# EAGLE design Final Project (EAGLE 8.6.3)

## Sheet 1 of 2: Power supply
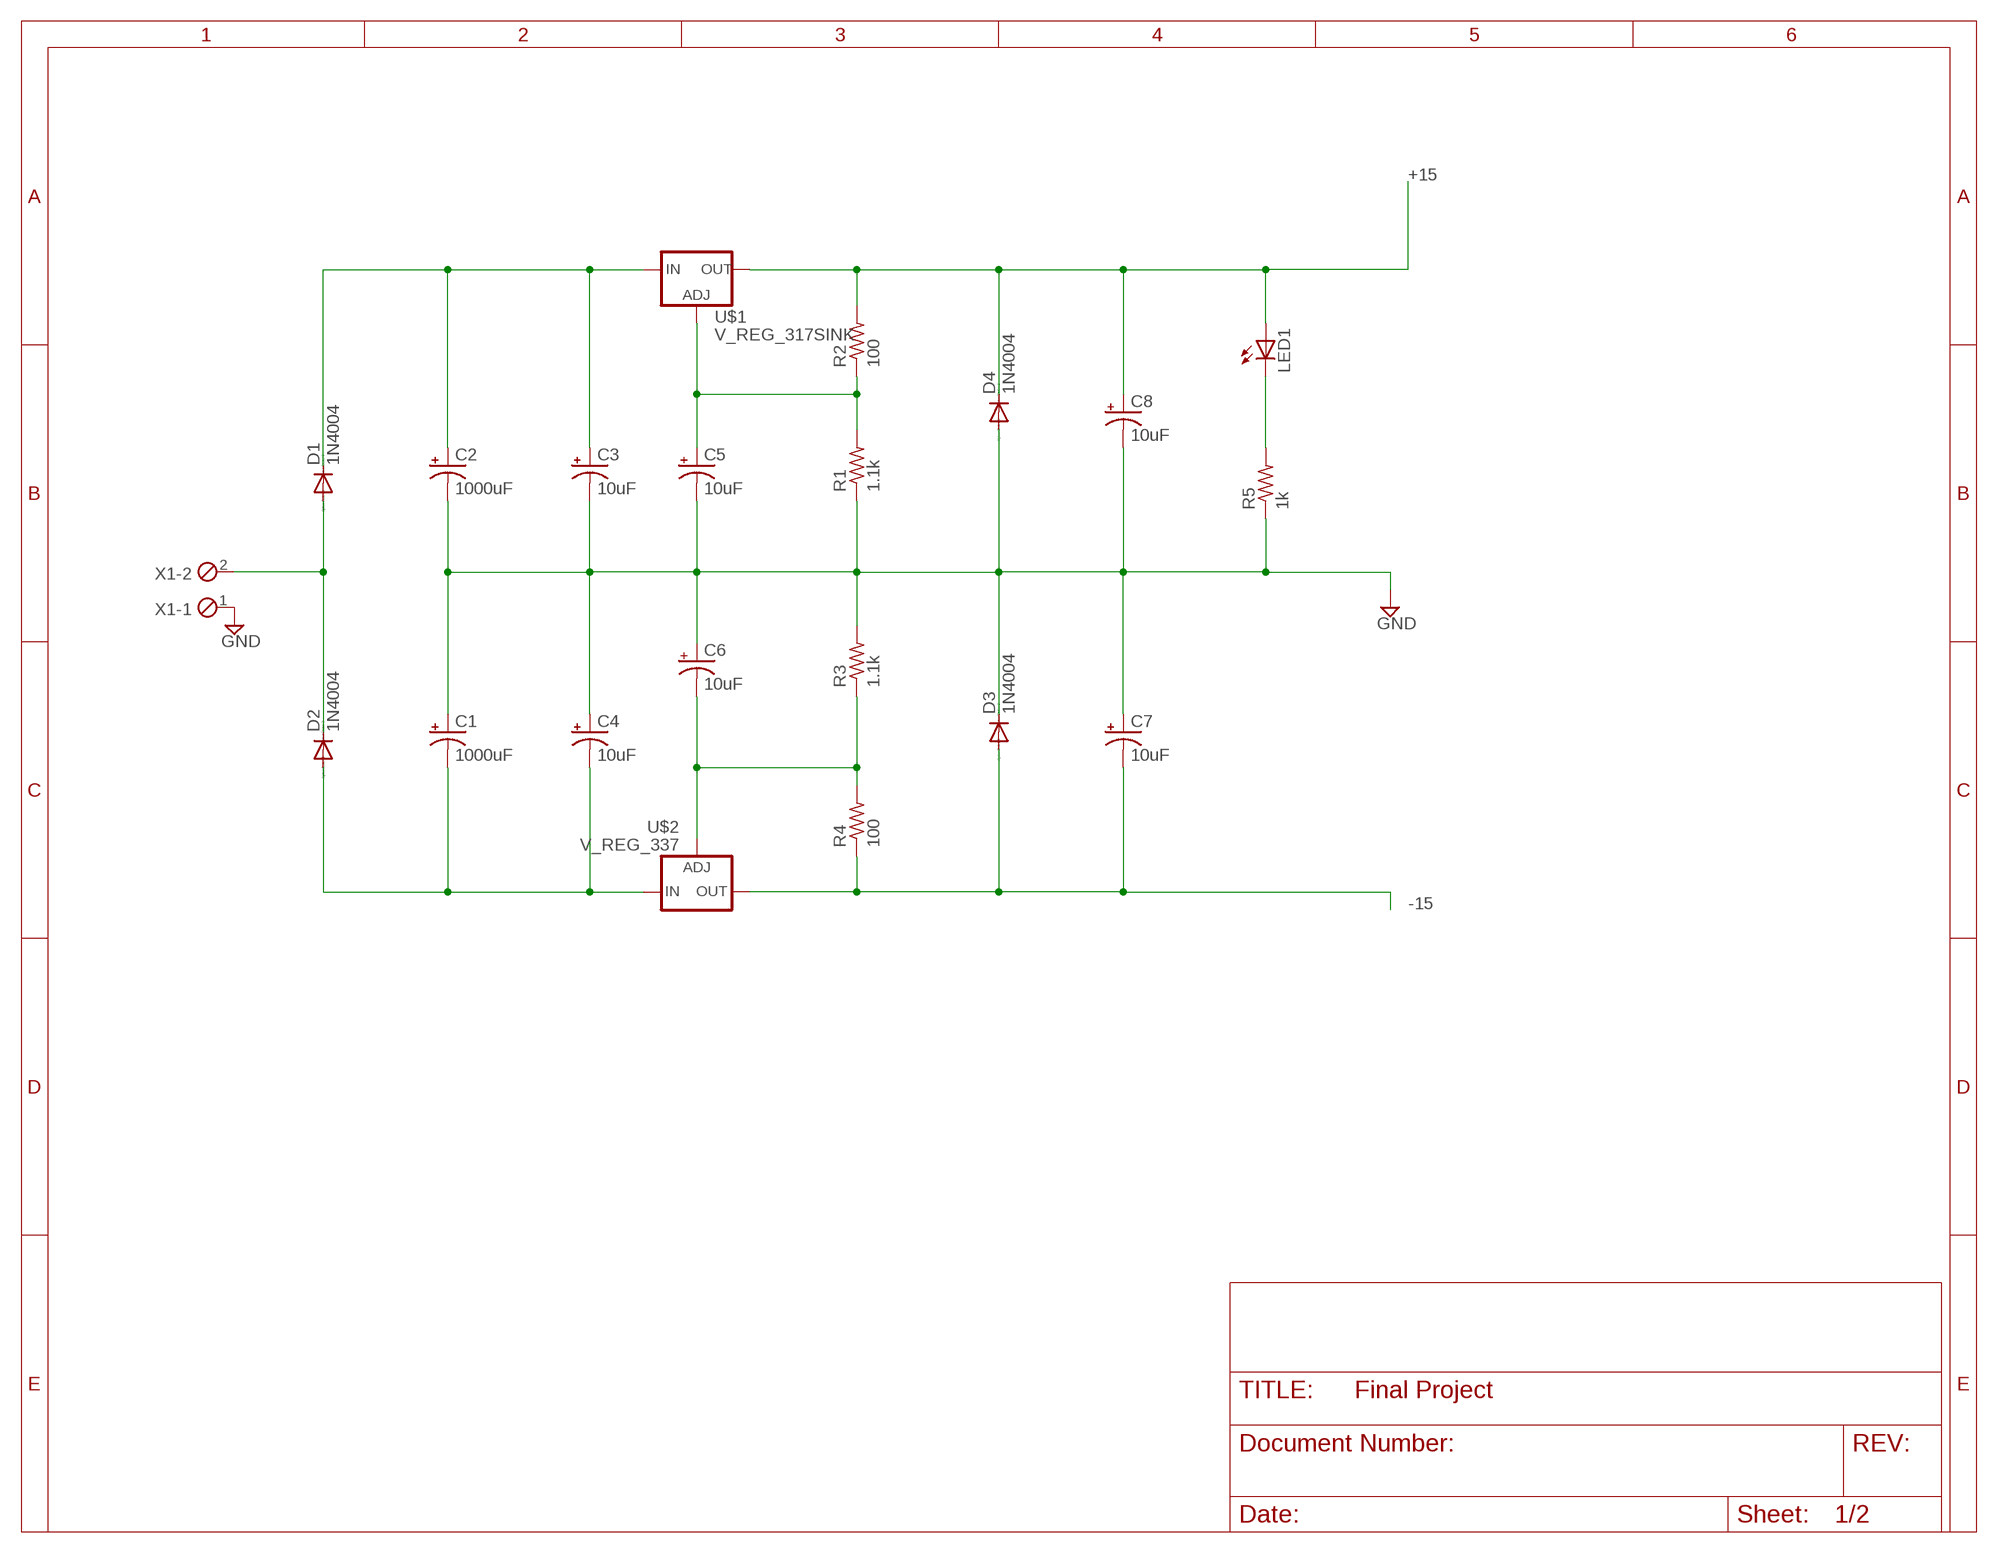
[diagram p0: schematic, sheet 1]

### Parts
C1  1000uF  CPOL-USE5-10.5  [E5-10,5]
C2  1000uF  CPOL-USE5-10.5  [E5-10,5]
C3  10uF  CPOL-USE2-5  [E2-5]
C4  10uF  CPOL-USE2-5  [E2-5]
C5  10uF  CPOL-USE2-5  [E2-5]
C6  10uF  CPOL-USE2-5  [E2-5]
C7  10uF  CPOL-USE2-5  [E2-5]
C8  10uF  CPOL-USE2-5  [E2-5]
D1  1N4004  [DO41-10]
D2  1N4004  [DO41-10]
D3  1N4004  [DO41-10]
D4  1N4004  [DO41-10]
LED1  LED5MM  [LED5MM]
R1  1.1k  R-US_0204/7  [0204/7]
R2  100  R-US_0204/7  [0204/7]
R3  1.1k  R-US_0204/7  [0204/7]
R4  100  R-US_0204/7  [0204/7]
R5  1k  R-US_0204/7  [0204/7]
U$1  V_REG_317SINK  [TO220-ADJ]
U$2  V_REG_337  [TO220-ADJ-NEG]
X1  MPT2  [2POL254]

### Nets
+15: C8.+ D4.C LED1.A R2.2 U$1.OUT ; also sheet 2
-15: C7.- D3.A R4.1 U$2.OUT ; also sheet 2
GND: C1.+ C2.- C3.- C4.+ C5.- C6.+ C7.+ C8.- D3.C D4.A R1.1 R3.2 R5.1 X1.1 ; also sheet 2
N$1: C2.+ C3.+ D1.C U$1.IN
N$2: C5.+ R1.2 R2.1 U$1.ADJ
N$3: D1.A D2.C X1.2
N$4: C1.- C4.- D2.A U$2.IN
N$5: LED1.K(C) R5.2
N$6: C6.- R3.1 R4.2 U$2.ADJ

## Sheet 2 of 2
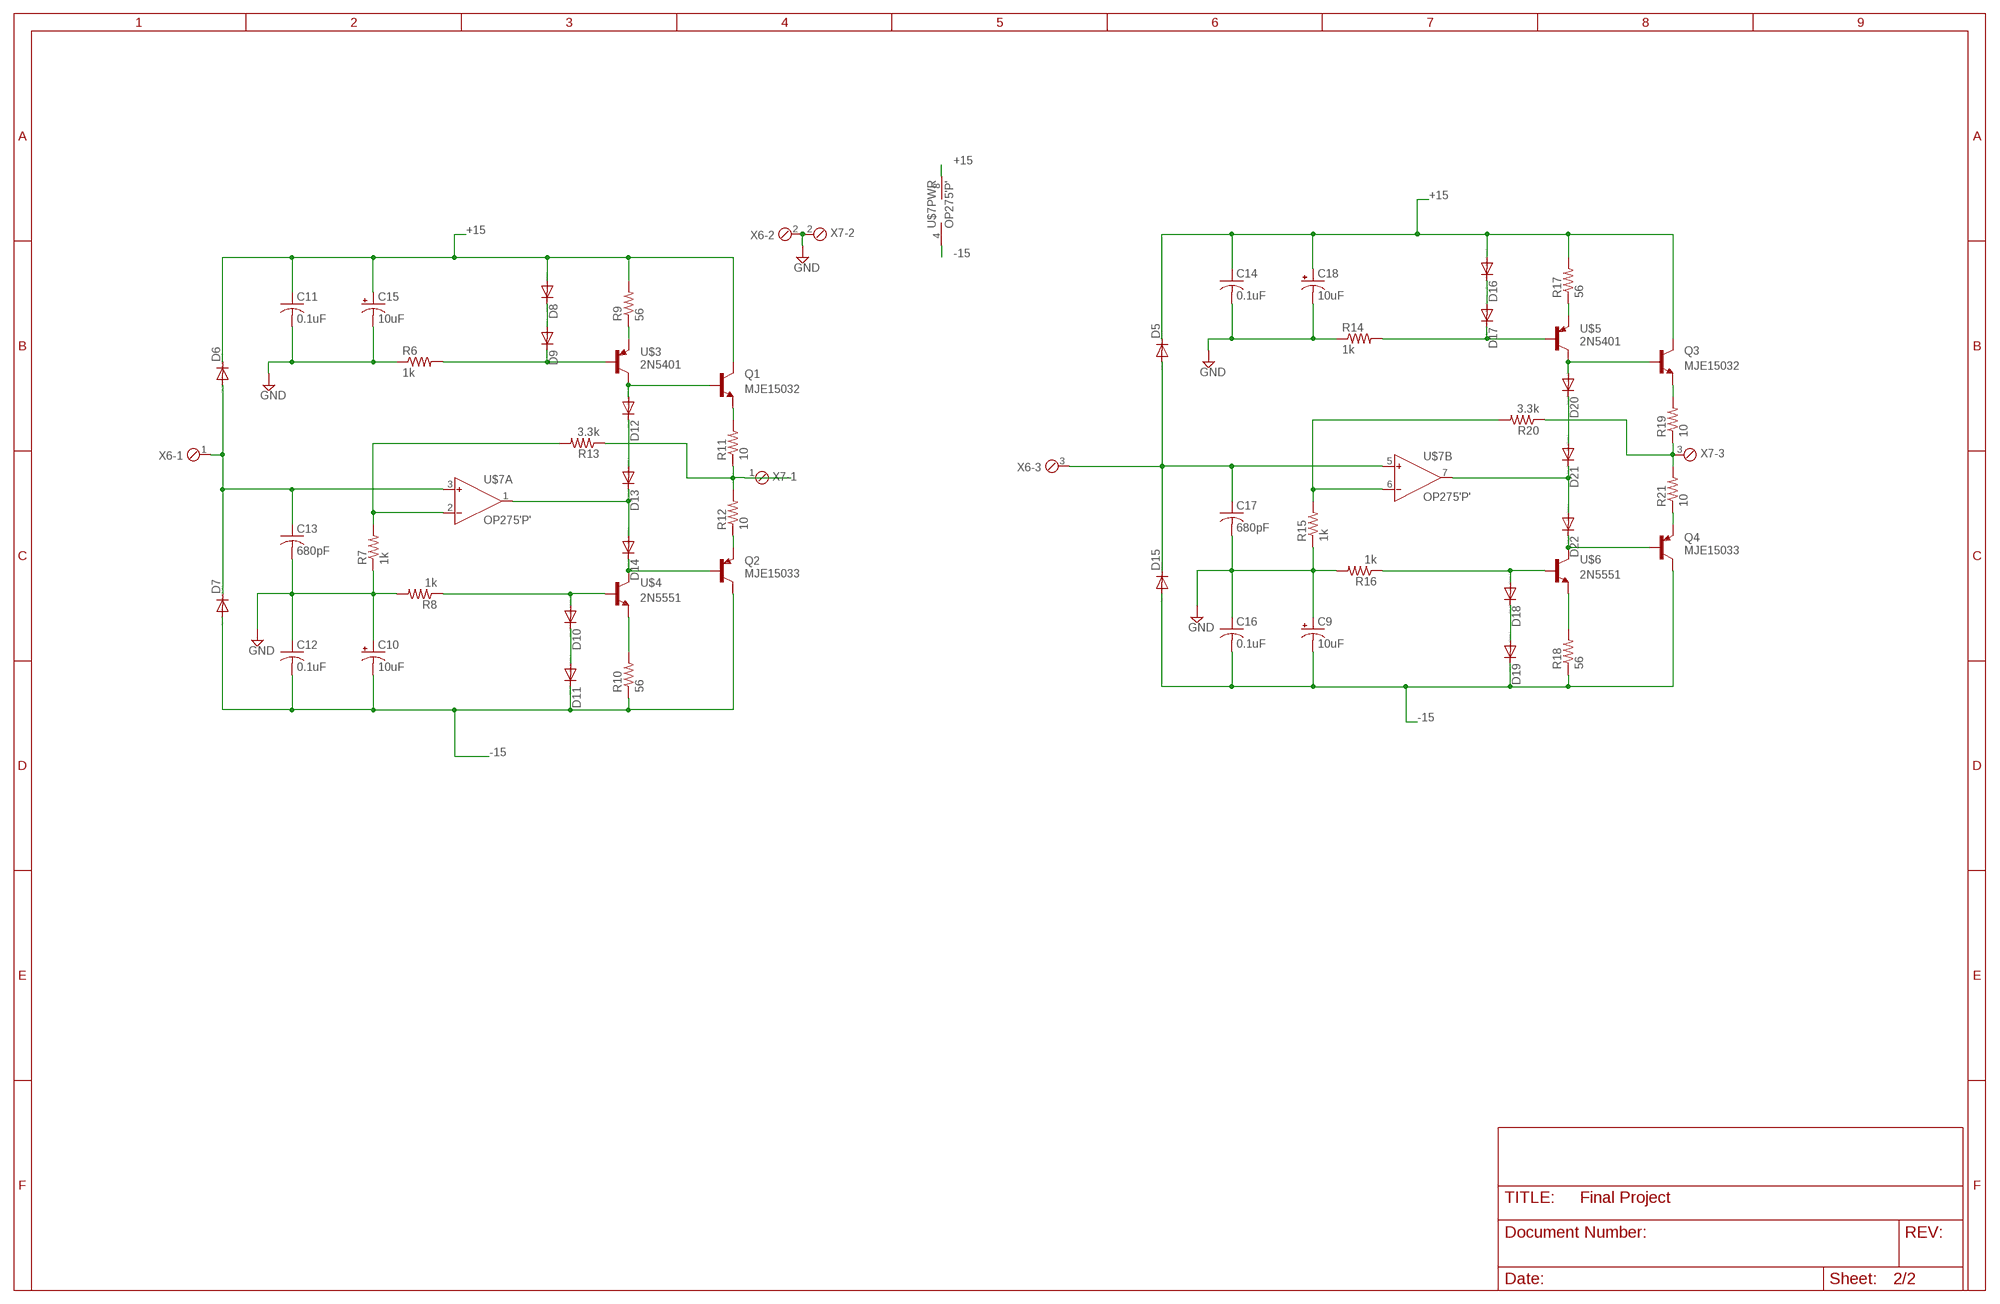
[diagram p1: schematic, sheet 2]

### Parts
C9  10uF  CPOL-USE2-5  [E2-5]
C10  10uF  CPOL-USE2-5  [E2-5]
C11  0.1uF  C-US025-025X050  [C025-025X050]
C12  0.1uF  C-US025-025X050  [C025-025X050]
C13  680pF  C-US025-025X050  [C025-025X050]
C14  0.1uF  C-US025-025X050  [C025-025X050]
C15  10uF  CPOL-USE2-5  [E2-5]
C16  0.1uF  C-US025-025X050  [C025-025X050]
C17  680pF  C-US025-025X050  [C025-025X050]
C18  10uF  CPOL-USE2-5  [E2-5]
D5  1N4148DO35-10  [DO35-10]
D6  1N4148DO35-10  [DO35-10]
D7  1N4148DO35-10  [DO35-10]
D8  1N4148DO35-10  [DO35-10]
D9  1N4148DO35-10  [DO35-10]
D10  1N4148DO35-10  [DO35-10]
D11  1N4148DO35-10  [DO35-10]
D12  1N4148DO35-10  [DO35-10]
D13  1N4148DO35-10  [DO35-10]
D14  1N4148DO35-10  [DO35-10]
D15  1N4148DO35-10  [DO35-10]
D16  1N4148DO35-10  [DO35-10]
D17  1N4148DO35-10  [DO35-10]
D18  1N4148DO35-10  [DO35-10]
D19  1N4148DO35-10  [DO35-10]
D20  1N4148DO35-10  [DO35-10]
D21  1N4148DO35-10  [DO35-10]
D22  1N4148DO35-10  [DO35-10]
Q1  MJE15032  [TO220V]
Q2  MJE15033  [TO220V]
Q3  MJE15032  [TO220V]
Q4  MJE15033  [TO220V]
R6  1k  R-US_0204/7  [0204/7]
R7  1k  R-US_0204/7  [0204/7]
R8  1k  R-US_0204/7  [0204/7]
R9  56  R-US_0204/7  [0204/7]
R10  56  R-US_0204/7  [0204/7]
R11  10  R-US_0204/7  [0204/7]
R12  10  R-US_0204/7  [0204/7]
R13  3.3k  R-US_0204/7  [0204/7]
R14  1k  R-US_0204/7  [0204/7]
R15  1k  R-US_0204/7  [0204/7]
R16  1k  R-US_0204/7  [0204/7]
R17  56  R-US_0204/7  [0204/7]
R18  56  R-US_0204/7  [0204/7]
R19  10  R-US_0204/7  [0204/7]
R20  3.3k  R-US_0204/7  [0204/7]
R21  10  R-US_0204/7  [0204/7]
U$3  2N5401  [2N5401]
U$4  2N5551  [2N5551]
U$5  2N5401  [2N5401]
U$6  2N5551  [2N5551]
U$7  OP275'P'  [DIL08]
X6  MPT3  [3POL254]
X7  MPT3  [3POL254]

### Nets
+15: C11.1 C14.1 C15.+ C18.+ D5.C D6.C D8.A D16.A Q1.2(C) Q3.2(C) R9.2 R17.2 U$7.8(PWR:V+) ; also sheet 1
-15: C9.- C10.- C12.2 C16.2 D7.A D11.C D15.A D19.C Q2.2(C) Q4.2(C) R10.1 R18.1 U$7.4(PWR:V-) ; also sheet 1
GND: C9.+ C10.+ C11.2 C12.1 C13.2 C14.2 C15.- C16.1 C17.2 C18.- R6.1 R7.1 R8.2 R14.1 R15.1 R16.2 X6.2 X7.2 ; also sheet 1
N$7: C13.1 D6.A D7.C U$7.3(A:IN+) X6.1
N$8: D10.A R8.1 U$4.B
N$9: Q2.3(E) R12.1
N$10: C17.1 D5.A D15.C U$7.5(B:IN+) X6.3
N$11: D16.C D17.A
N$12: R15.2 R20.2 U$7.6(B:IN-)
N$13: D18.A R16.1 U$6.B
N$14: D8.C D9.A
N$15: D9.C R6.2 U$3.B
N$16: R7.2 R13.2 U$7.2(A:IN-)
N$17: D17.C R14.2 U$5.B
N$18: D18.C D19.A
N$19: R17.1 U$5.E
N$20: D10.C D11.A
N$21: R9.1 U$3.E
N$22: D12.A Q1.1(B) U$3.C
N$23: D12.C D13.A
N$24: D13.C D14.A U$7.1(A:OUT)
N$25: D14.C Q2.1(B) U$4.C
N$26: R10.2 U$4.E
N$27: Q1.3(E) R11.2
N$28: R11.1 R12.2 R13.1 X7.1
N$29: D20.A Q3.1(B) U$5.C
N$30: D20.C D21.A
N$31: D21.C D22.A U$7.7(B:OUT)
N$32: D22.C Q4.1(B) U$6.C
N$33: R18.2 U$6.E
N$34: Q3.3(E) R19.2
N$35: R19.1 R20.1 R21.2 X7.3
N$36: Q4.3(E) R21.1

## Library data of the parts
C1 C2 = rcl:CPOL-US: POLARIZED CAPACITOR, American symbol
C3-C10 C15 C18 = rcl:CPOL-US: POLARIZED CAPACITOR, American symbol; SPICEPREFIX: C
C11-C14 C16 C17 = rcl:C-US: CAPACITOR, American symbol; SPICEPREFIX: C
D1-D4 = diode:1N4004: DIODE general purpose rectifier, 1 A
D5-D22 = diode:1N4148: DIODE high speed (Philips)
LED1 = led:LED: LED OSRAM: - CHIPLED LG R971, LG N971, LY N971, LG Q971, LY Q971, LO R971, LY R971 LH N974, LH R974 LS Q976, LO Q976, LY Q976 LO Q996 - Hyper CHIPLED LW Q18S LB Q993, LB Q99A, LB R99A - SideLED LS A670, LO A670, LY A670, LG A670, LP A670 LB A673, LV A673, LT A673, LW A673 LH A674 LY A675 LS A676, LA A676, LO A676, LY A676, LW A676 LS A679, LY A679, LG A679 - Hyper Micro SIDELED® LS Y876, LA Y876, LO Y876, LY Y876 LT Y87S - SmartLED LW L88C, LW L88S LB L89C, LB L89S, LG L890 LS L89K, LO L89K, LY L89K LS L896, LA L896, LO L896, LY L896 - TOPLED LS T670, LO T670, LY T670, LG T670, LP T670 LSG T670, LSP T670, LSY T670, LOP T670, LYG T670 LG T671, LOG T671, LSG T671 LB T673, LV T673, LT T673, LW T673 LH T674 LS T676, LA T676, LO T676, LY T676, LB T676, LH T676, LSB T676, LW T676 LB T67C, LV T67C, LT T67C, LS T67K, LO T67K, LY T67K, LW E67C LS E67B, LA E67B, LO E67B, LY E67B, LB E67C, LV E67C, LT E67C LW T67C LS T679, LY T679, LG T679 LS T770, LO T770, LY T770, LG T770, LP T770 LB T773, LV T773, LT T773, LW T773 LH T774 LS E675, LA E675, LY E675, LS T675 LS T776, LA T776, LO T776, LY T776, LB T776 LHGB T686 LT T68C, LB T68C - Hyper Mini TOPLED® LB M676 - Mini TOPLED Santana® LG M470 LS M47K, LO M47K, LY M47K Source: http://www.osram.convergy.de LUXEON: - LUMILED® LXK2-PW12-R00, LXK2-PW12-S00, LXK2-PW14-U00, LXK2-PW14-V00 LXK2-PM12-R00, LXK2-PM12-S00, LXK2-PM14-U00 LXK2-PE12-Q00, LXK2-PE12-R00, LXK2-PE12-S00, LXK2-PE14-T00, LXK2-PE14-U00 LXK2-PB12-K00, LXK2-PB12-L00, LXK2-PB12-M00, LXK2-PB14-N00, LXK2-PB14-P00, LXK2-PB14-Q00 LXK2-PR12-L00, LXK2-PR12-M00, LXK2-PR14-Q00, LXK2-PR14-R00 LXK2-PD12-Q00, LXK2-PD12-R00, LXK2-PD12-S00 LXK2-PH12-R00, LXK2-PH12-S00 LXK2-PL12-P00, LXK2-PL12-Q00, LXK2-PL12-R00 Source: www.luxeon.com KINGBRIGHT: KA-3528ASYC Source: www.kingbright.com
Q1 Q3 = engr301-proj :MJE15032: NPN Power Transistor HF Audio Driver 8.0A, 250V, 50W
Q2 Q4 = engr301-proj :MJE15033: PNP Power Transistor HF Audio Driver 8.0A, 250V, 50W
R1 R3-R5 = rcl:R-US_: RESISTOR, American symbol
R2 R6-R21 = rcl:R-US_: RESISTOR, American symbol; SPICEPREFIX: R
U$1 = engr301-proj  (4):V_REG_317: Voltage Regulator Standard LM317 adjustable voltage regulator. AOI (Adjust Output Input). Google 'LM317 Calculator' for easy to use app to get the two resistor values needed. 240/720 for 5V output. 240/390 for 3.3V output. Spark Fun Electronics SKU : COM-00527
U$2 = engr301-proj  (4):V_REG_337: LM-337 Negative Adjustable Voltage Regulator
U$3 U$5 = engr301-proj :2N5401
U$4 U$6 = engr301-proj :2N5551
U$7 = engr301-proj :OP275: OP275 - Dual Bipolar/JFET Audio Op-amp
X1 = con-phoenix-254:MPT2: PHOENIX CONNECTOR; OC_FARNELL: unknown; OC_NEWARK: unknown
X6 X7 = con-phoenix-254:MPT3: PHOENIX CONNECTOR; OC_FARNELL: unknown; OC_NEWARK: unknown

## Board
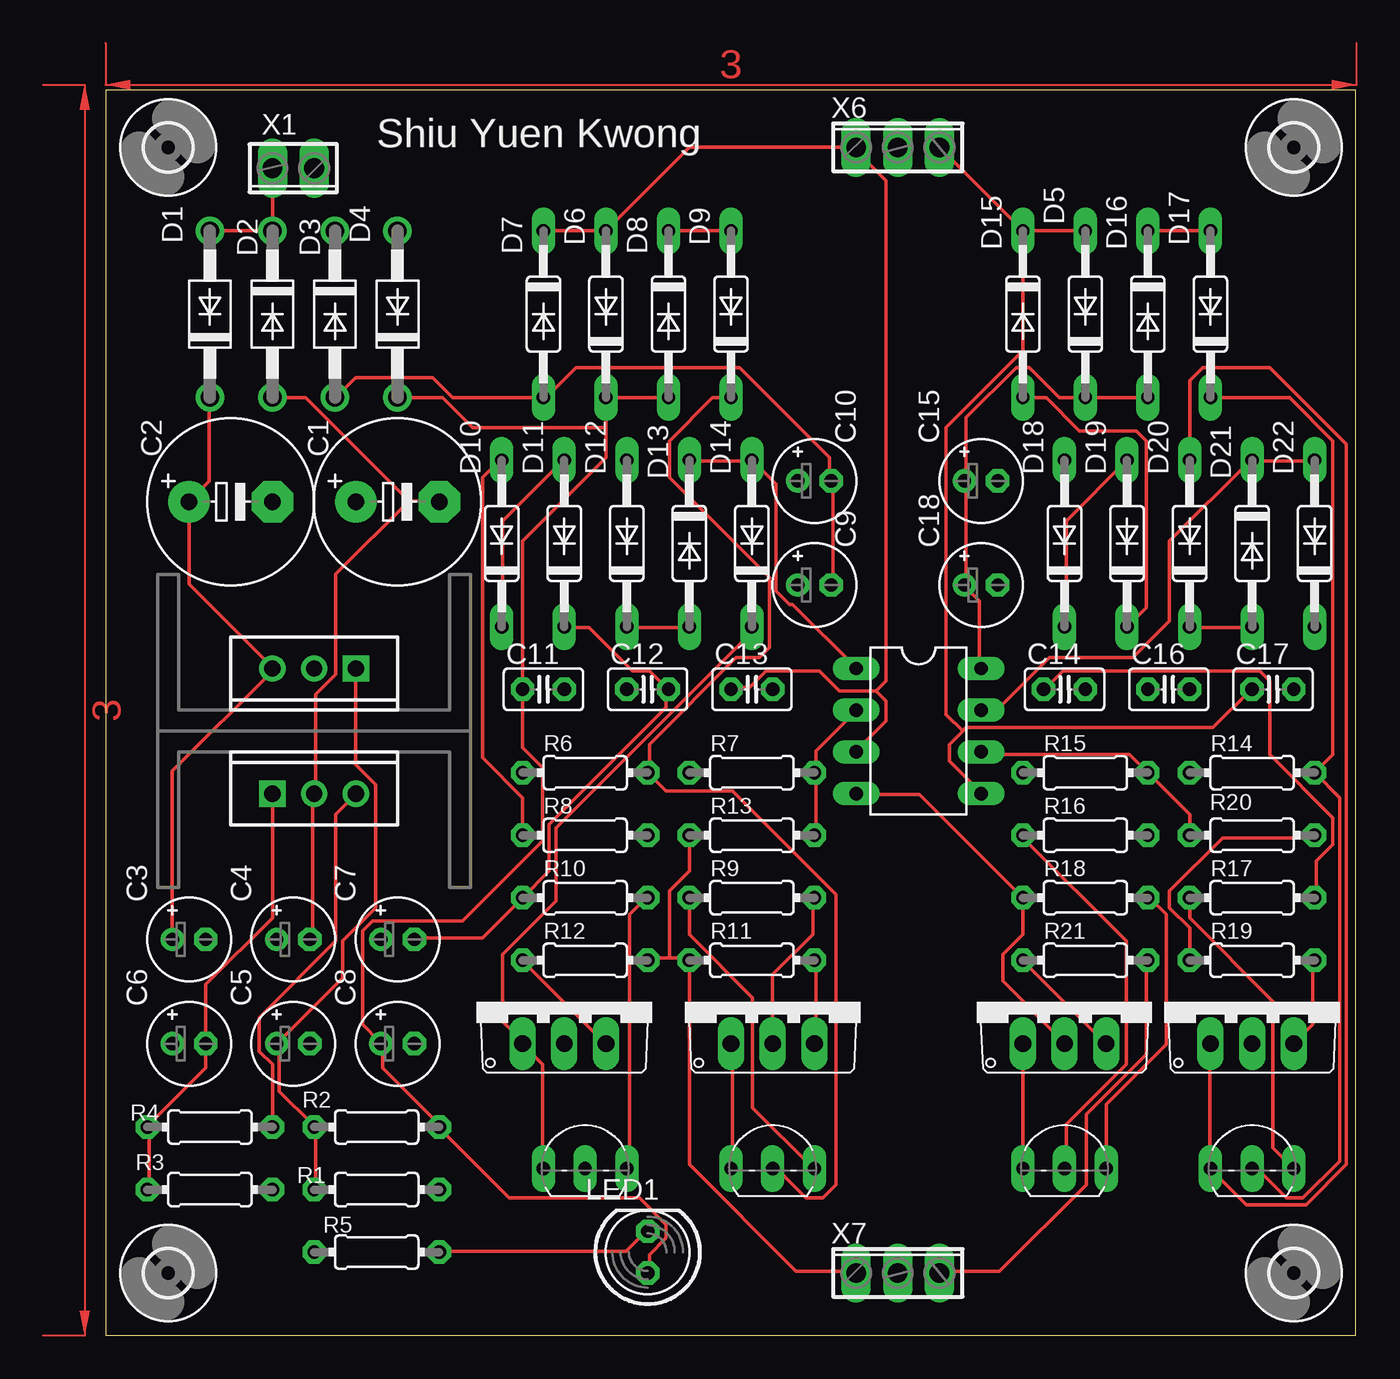
[diagram p2: board, top side]
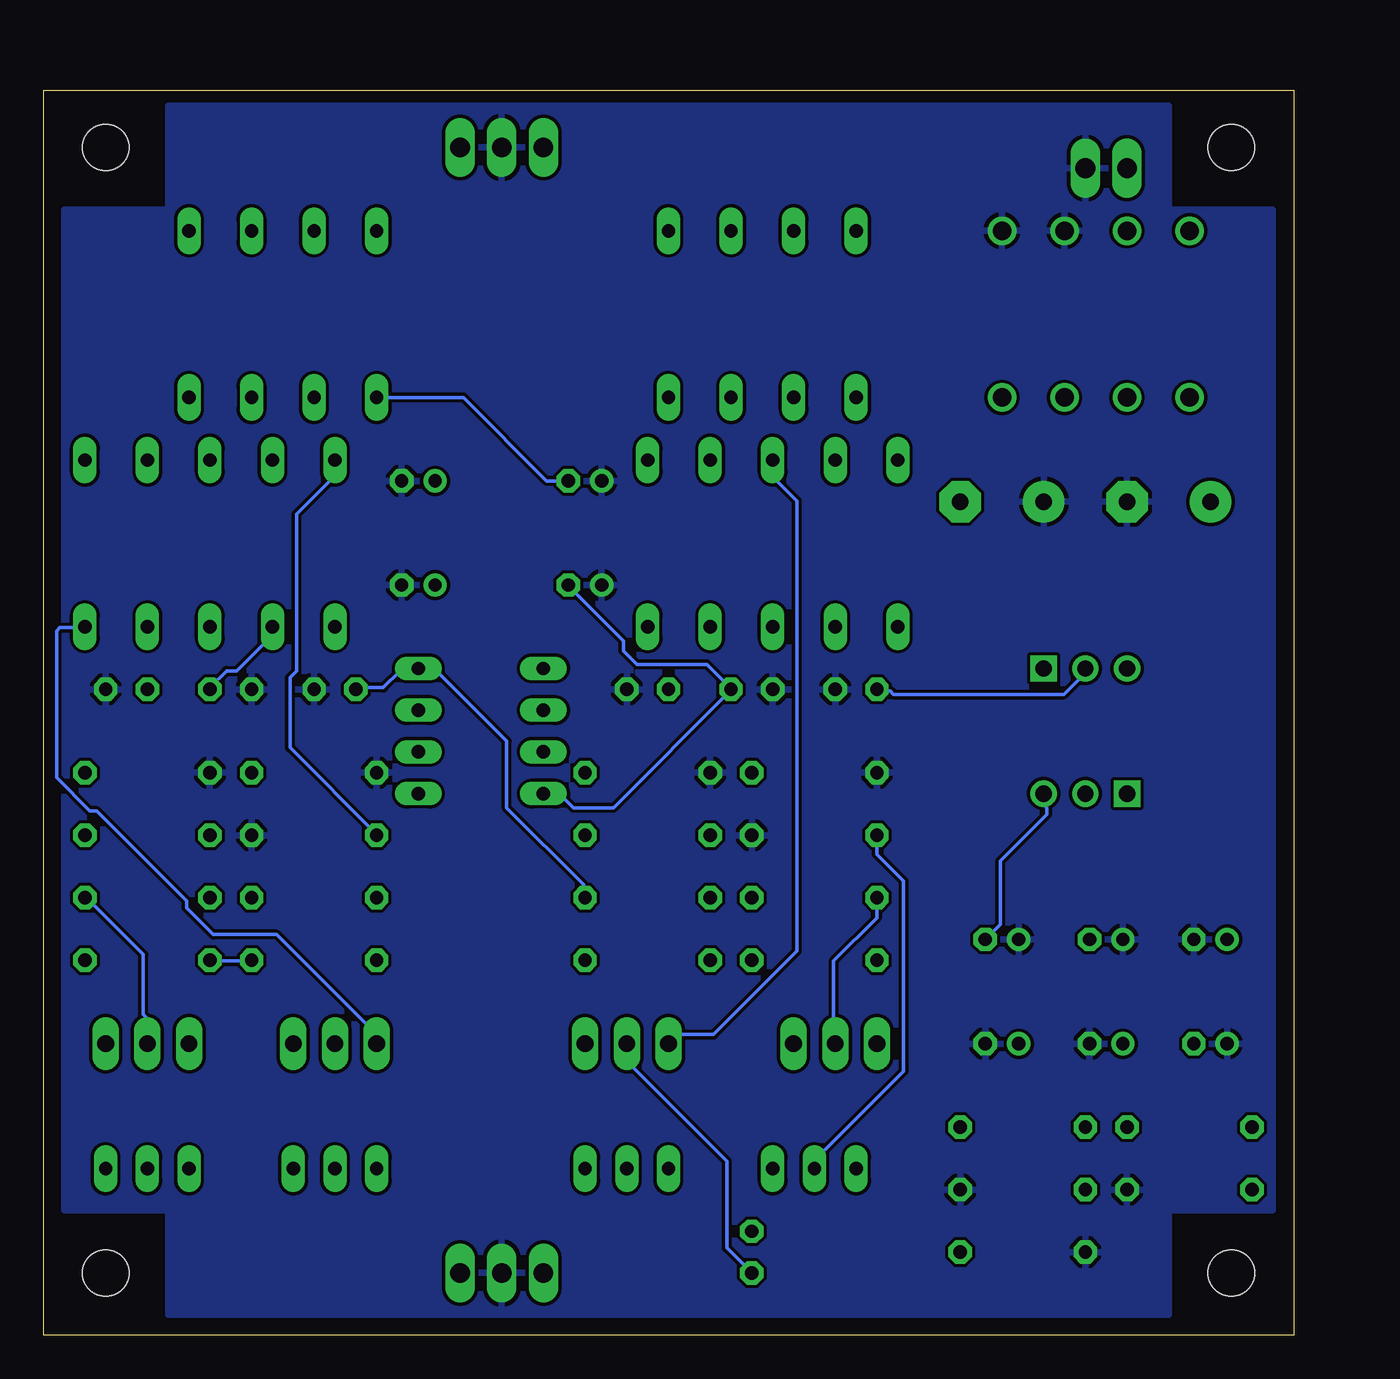
[diagram p3: board, bottom side, seen from below]

Size 76.18 x 75.87 mm. Coordinates in mm from the lower left corner, seen from the top.
Outline: 0,0 76.18,0 76.18,75.87 0,75.87 0,0
Copper layers (1*16): Top 0.035mm / dielectric 1.5mm / Bottom 0.035mm
Design rules "engr301_new": minimum track width 8mil, minimum drill 20mil, track to track 8mil, track to pad 10mil, pad to pad 10mil, via to via 10mil, smd to smd 8mil, copper to edge 15mil, drill to drill 8mil, minimum pad ring 12mil, minimum via ring 10mil, stop-mask expansion 4mil, vias tented up to drill 25mil, thermal gap 10mil

### Footprints (pad centres in the part's own frame; a part is rotated, then mirrored left to right if it is on the bottom)
E5-10,5 = drill 1.016 pad 2.54: + -2.54,0 | drill 1.016 pad 2.54 octagon: - 2.54,0
E2-5 = drill 0.813 pad 1.27: + -1.016,0 | drill 0.813 pad 1.27 octagon: - 1.016,0
C025-025X050 = drill 0.813 octagon: 1 -1.27,0; 2 1.27,0
DO41-10 = drill 1.118: A 5.08,0; C -5.08,0
DO35-10 = drill 0.813 long: A 5.08,0; C -5.08,0
LED5MM = drill 0.813 octagon: A -1.27,0; K 1.27,0
TO220V = drill 1.016 long: 1 -2.54,-2.54; 2 0,-2.54; 3 2.54,-2.54
0204/7 = drill 0.813 octagon: 1 -3.81,0; 2 3.81,0
TO220-ADJ = drill 1 square: ADJ -2.54,0 | drill 1: IN 2.54,0; OUT 0,0
TO220-ADJ-NEG = drill 1 square: ADJ -2.54,0 | drill 1: IN 0,0; OUT 2.54,0
2N5401 = drill 0.813 long: B 0,0; C -2.54,0; E 2.54,0
2N5551 = drill 0.813 long: B 0,0; C -2.54,0; E 2.54,0
DIL08 = drill 0.813 long: 1 -3.81,-3.81; 2 -1.27,-3.81; 3 1.27,-3.81; 4 3.81,-3.81; 5 3.81,3.81; 6 1.27,3.81; 7 -1.27,3.81; 8 -3.81,3.81
2,8 = hole 2.8: 0,0
2POL254 = drill 1.2 long: 1 -1.27,0; 2 1.27,0
3POL254 = drill 1.2 long: 1 -2.54,0; 2 0,0; 3 2.54,0

### Placement (x,y rotation side)
C1  17.78,50.8 0 top
C2  7.62,50.8 0 top
C3  5.08,24.13 0 top
C4  11.43,24.13 0 top
C5  11.43,17.78 0 top
C6  5.08,17.78 0 top
C7  17.78,24.13 0 top
C8  17.78,17.78 0 top
C9  43.18,45.72 0 top
C10  43.18,52.07 0 top
C11  26.67,39.37 0 top
C12  33.02,39.37 0 top
C13  39.37,39.37 0 top
C14  58.42,39.37 0 top
C15  53.34,52.07 0 top
C16  64.77,39.37 0 top
C17  71.12,39.37 0 top
C18  53.34,45.72 0 top
D1  6.35,62.23 90 top
D2  10.16,62.23 270 top
D3  13.97,62.23 270 top
D4  17.78,62.23 90 top
D5  59.69,62.23 90 top
D6  30.48,62.23 90 top
D7  26.67,62.23 270 top
D8  34.29,62.23 270 top
D9  38.1,62.23 90 top
D10  24.13,48.26 90 top
D11  27.94,48.26 90 top
D12  31.75,48.26 90 top
D13  35.56,48.26 270 top
D14  39.37,48.26 90 top
D15  55.88,62.23 270 top
D16  63.5,62.23 270 top
D17  67.31,62.23 90 top
D18  58.42,48.26 90 top
D19  62.23,48.26 90 top
D20  66.04,48.26 90 top
D21  69.85,48.26 270 top
D22  73.66,48.26 90 top
LED1  33.02,5.08 90 top
Q1  40.64,20.32 0 top
Q2  27.94,20.32 0 top
Q3  69.85,20.32 0 top
Q4  58.42,20.32 0 top
R1  16.51,8.89 180 top
R2  16.51,12.7 0 top
R3  6.35,8.89 0 top
R4  6.35,12.7 180 top
R5  16.51,5.08 0 top
R6  29.21,34.29 0 top
R7  39.37,34.29 0 top
R8  29.21,30.48 0 top
R9  39.37,26.67 0 top
R10  29.21,26.67 0 top
R11  39.37,22.86 0 top
R12  29.21,22.86 0 top
R13  39.37,30.48 0 top
R14  69.85,34.29 0 top
R15  59.69,34.29 0 top
R16  59.69,30.48 0 top
R17  69.85,26.67 0 top
R18  59.69,26.67 0 top
R19  69.85,22.86 0 top
R20  69.85,30.48 180 top
R21  59.69,22.86 0 top
U$1  12.7,40.64 180 top
U$2  12.7,33.02 0 top
U$3  40.64,10.16 0 top
U$4  29.21,10.16 0 top
U$5  69.85,10.16 0 top
U$6  58.42,10.16 0 top
U$7  49.53,36.83 270 top
U$8  [2,8]  3.81,72.39 0 top
U$9  [2,8]  72.39,72.39 0 top
U$10  [2,8]  72.39,3.81 0 top
U$11  [2,8]  3.81,3.81 0 top
X1  11.43,71.12 180 top
X6  48.26,72.39 0 top
X7  48.26,3.81 0 top

### Tracks (layer width: path | path; a pad name or v marks a point on that pad's centre or on a via)
+15
  Top 0.203: D16.A D5.C 58.12,57.15 56.29,58.98 55.47,58.98 52.43,55.93 52.43,52.07 | U$7.8 53.24,40.69 53.24,44.76 52.43,45.57 C18.+ 52.43,45.77 52.43,52.07 | 52.43,52.07 C15.+ | R17.2 73.76,26.67 73.76,28.9 74.78,29.92 74.78,31.55 70.92,35.41 70.92,39.88 70.31,40.49 58.32,40.49 57.3,39.47 C14.1 | 30.48,55.32 D6.C D8.A | 30.48,55.32 30.48,53.49 25.4,48.41 C11.1 25.4,35.81 26.62,34.59 26.62,30.12 21.74,25.25 16.26,25.25 15.65,24.64 15.65,18.95 16.66,17.93 C8.+ 16.87,17.73 16.87,16.31 20.32,12.85 R2.2 20.32,12.65 24.59,8.38 32.51,8.38 34.14,6.76 34.14,5.94 33.12,4.93 33.12,3.91 LED1.A | D4.C 20.52,57.15 22.35,55.32 30.48,55.32 | Q1.2 40.64,22 43.08,24.43 43.08,26.67 R9.2
  Bottom 0.203: R17.2 73.56,26.67 70.1,23.22 70.1,19.56 69.9,19.36 69.9,17.93 Q3.2 | C14.1 57.1,39.47 55.47,39.47 54.46,40.49 53.44,40.49 U$7.8 53.24,40.49 52.22,40.49 47.95,36.22 47.95,32.16 43.28,27.48 43.28,26.67 R9.2 | U$1.OUT 12.8,40.49 12.8,40.28 14.02,39.06 24.38,39.06 24.59,39.27 25.4,39.27 C11.1 | Q1.2 40.64,16.71 34.54,10.62 34.54,5.33 LED1.A
-15
  Top 0.203: D15.A 57.3,57.15 59.33,55.12 62.79,55.12 63.4,54.51 63.4,44.35 D19.C | C9.- 44.3,45.77 44.3,52.07 C10.- 44.09,52.07 44.09,53.49 38.61,58.98 28.65,58.98 26.82,57.15 D7.A 21.13,57.15 19.91,58.37 15.24,58.37 14.02,57.15 D3.A | Q4.2 58.32,17.93 54.66,21.59 54.66,23.22 55.88,24.43 R18.1 49.58,32.97 45.72,32.97 U$7.4 | R4.1 10.16,16.51 9.35,17.32 9.35,19.36 14.02,24.03 14.02,31.75 15.24,32.97 U$2.OUT | D11.C 28.04,43.13 29.46,43.13 32.11,40.49 33.12,40.49 34.14,39.47 C12.2 34.14,39.27 34.14,38.25 27.03,31.14 27.03,28.3 R10.1 22.96,24.23 18.9,24.23 C7.-
  Bottom 0.203: D19.C 62.38,43.13 62.38,42.52 64.41,40.49 65.02,40.49 66.04,39.47 C16.2 | D15.A 50.6,57.15 45.52,52.07 C10.- | R10.1 25.4,25.45 28.04,22.81 28.04,17.93 Q2.2 | U$2.OUT 15.24,32.36 15.04,32.16 15.04,31.75 17.88,28.9 17.88,25.04 C7.- | U$7.4 45.72,32.97 44.7,32.97 43.89,32.16 41.45,32.16 34.34,39.27 C12.2 34.34,39.47 35.76,40.89 40.03,40.89 40.84,41.71 40.84,42.32 44.09,45.57 C9.-
GND
  pour Bottom: 10.16,74.93 7.62,74.93 7.62,68.58 1.27,68.58 1.27,7.62 5.08,7.62 7.62,7.62 7.62,1.27 68.58,1.27 68.58,5.08 68.58,7.62 74.93,7.62 74.93,68.58 68.58,68.58 68.58,74.93
N$1
  Top 0.203: D1.C 6.3,57.15 6.3,52.07 5.08,50.85 C2.+ 5.08,45.77 10.16,40.69 U$1.IN 10.16,40.49 4.06,34.39 C3.+
N$2
  Top 0.203: R1.2 12.8,8.99 12.8,12.65 R2.1 12.6,12.85 10.57,14.88 10.57,17.73 C5.+ 14.43,21.79 14.43,24.03 16.46,26.06 16.46,33.58 15.24,34.8 U$1.ADJ
N$3
  Top 0.203: D1.A D2.C X1.2
N$4
  Top 0.203: C4.- 12.6,24.23 12.6,32.97 U$2.IN 12.8,33.17 12.8,39.06 14.02,40.28 14.02,46.38 18.49,50.85 | D2.A 12.19,57.15 18.49,50.85 | 18.49,50.85 20.32,50.85 C1.-
N$5
  Top 0.203: R5.2 20.32,5.13 31.7,5.13 32.92,6.35 LED1.K
N$6
  Top 0.203: R3.1 2.64,8.99 2.64,12.65 R4.2 2.64,12.85 6.1,16.31 C6.- 6.1,21.39 10.16,25.45 U$2.ADJ
N$7
  Top 0.203: 46.94,39.27 44.7,39.27 43.48,40.49 40.23,40.49 39.22,39.47 38.2,39.47 C13.1 | 46.94,39.27 47.55,38.66 47.55,37.44 45.72,35.61 U$7.3 | D7.C D6.A 35.56,72.39 45.52,72.39 | 46.94,39.27 47.55,39.88 47.55,70.36 45.52,72.39 | 45.52,72.39 X6.1
N$8
  Top 0.203: R8.1 25.4,32.77 22.96,35.2 22.96,52.27 23.98,53.29 D10.A
  Bottom 0.203: R8.1 25.4,29.31 23.77,27.69 23.77,16.1 29.06,10.82 29.06,10.21 U$4.B
N$9
  Top 0.203: R12.1 25.4,22.81 30.48,17.73 Q2.3
N$10
  Top 0.203: D5.A D15.C | D15.C X6.3 | 52.22,36.83 52.43,37.03 67.46,37.03 69.7,39.27 C17.1 | 52.22,36.83 51.41,36.02 51.41,35 53.24,33.17 U$7.5 | D15.C 55.88,60 51.21,55.32 51.21,37.85 52.22,36.83
N$11
  Top 0.203: D17.A D16.C
N$12
  Top 0.203: R20.2 66.04,31.75 R15.2 62.38,35.41 53.44,35.41 U$7.6
N$13
  Top 0.203: U$6.B 58.52,10.21 58.52,12.85 62.18,16.51 62.18,24.03 55.88,30.33 R16.1
  Bottom 0.203: D18.A 58.52,53.29 58.52,52.27 60.76,50.04 60.76,40.49 61.16,40.08 61.16,35.81 55.88,30.53 R16.1
N$14
  Top 0.203: D9.A D8.C
N$15
  Top 0.203: D9.C 36.98,57.15 34.34,54.51 34.34,52.27 40.44,46.18 40.44,41.91 39.83,41.3 38.41,41.3 33.12,36.02 33.12,34.39 R6.2 34.14,33.17 38.2,33.17 44.5,26.87 44.5,9.2 43.69,8.38 42.67,8.38 41.05,10.01 40.64,10.01 U$3.B
N$16
  Top 0.203: R13.2 43.28,30.53 43.28,34.19 R7.2 43.28,34.39 43.28,35.61 45.72,38.05 U$7.2
N$17
  Top 0.203: U$5.B 69.9,10.01 70.31,10.01 71.93,8.38 72.95,8.38 75.18,10.62 75.18,32.77 R14.2 74.78,35.41 74.78,54.51 72.14,57.15 D17.C
N$18
  Top 0.203: D19.A 58.52,49.63 58.52,43.33 D18.C
N$19
  Top 0.203: R17.1 66.04,25.45 71.12,20.37 71.12,11.43 U$5.E
N$20
  Top 0.203: D10.C 24.18,43.33 24.18,49.63 27.84,53.29 D11.A
N$21
  Top 0.203: R9.1 35.56,24.43 39.42,20.57 39.42,13.87 43.08,10.21 U$3.E
N$22
  Top 0.203: U$3.C 38.2,10.21 38.2,17.73 Q1.1
  Bottom 0.203: D12.A 31.7,53.29 31.7,52.27 30.28,50.85 30.28,23.42 35.36,18.34 37.59,18.34 38,17.93 Q1.1
N$23
  Top 0.203: D12.C 31.9,43.13 35.56,43.13 D13.A
N$24
  Top 0.203: D13.C 35.56,53.29 39.22,53.29 D14.A 40.84,51.87 40.84,45.36 41.66,44.55 41.86,44.55 45.72,40.69 U$7.1
N$25
  Top 0.203: U$4.C 26.62,10.21 26.62,16.51 25.4,17.73 Q2.1 25.4,17.93 24.18,19.15 24.18,23.22 27.43,26.47 27.43,30.94 39.22,42.72 39.22,43.13 D14.C
N$26
  Top 0.203: U$4.E 31.9,10.21 31.9,25.65 32.92,26.67 R10.2
N$27
  Top 0.203: R11.2 43.28,22.81 43.28,17.93 Q1.3
N$28
  Top 0.203: 34.34,23.01 35.56,23.01 R11.1 35.56,10.41 42.06,3.91 45.72,3.91 X7.1 | 34.34,23.01 33.12,23.01 R12.2 | R13.1 35.56,28.3 34.34,27.08 34.34,23.01
N$29
  Top 0.203: Q3.1 67.26,17.73 67.26,10.21 U$5.C 69.49,7.98 73.15,7.98 75.59,10.41 75.59,54.31 70.92,58.98 66.85,58.98 66.04,58.17 D20.A
N$30
  Top 0.203: D20.C 66.04,43.13 69.7,43.13 D21.A
N$31
  Top 0.203: U$7.7 53.44,38.25 54.46,38.25 57.51,41.3 62.59,41.3 64.82,43.54 64.82,48.41 69.7,53.29 D21.C 69.9,53.29 73.56,53.29 D22.A
N$32
  Top 0.203: Q4.1 U$6.C
  Bottom 0.203: Q4.1 55.88,18.34 61.98,24.43 65.84,24.43 67.46,26.06 67.46,26.47 72.95,31.95 73.36,31.95 75.39,33.98 75.39,42.93 75.18,43.13 73.76,43.13 D22.C
N$33
  Top 0.203: U$6.E 60.96,14.07 64.62,17.73 64.62,25.65 63.6,26.67 R18.2
N$34
  Top 0.203: Q3.3 73.56,18.95 73.56,22.81 R19.2
N$35
  Top 0.203: R19.1 66.04,24.84 64.82,26.06 64.82,27.08 68.07,30.33 73.56,30.33 R20.1 | X7.3 50.8,3.91 54.46,3.91 59.74,9.2 59.74,13.46 63.4,17.12 63.4,22.81 R21.2
  Bottom 0.203: R21.2 63.6,22.81 66.04,22.81 R19.1
N$36
  Top 0.203: R21.1 55.88,22.81 60.96,17.73 Q4.3
(copper drawn outside any net)
  shapes: Top area x2

### Text on the board
tNames: Shiu Yuen Kwong